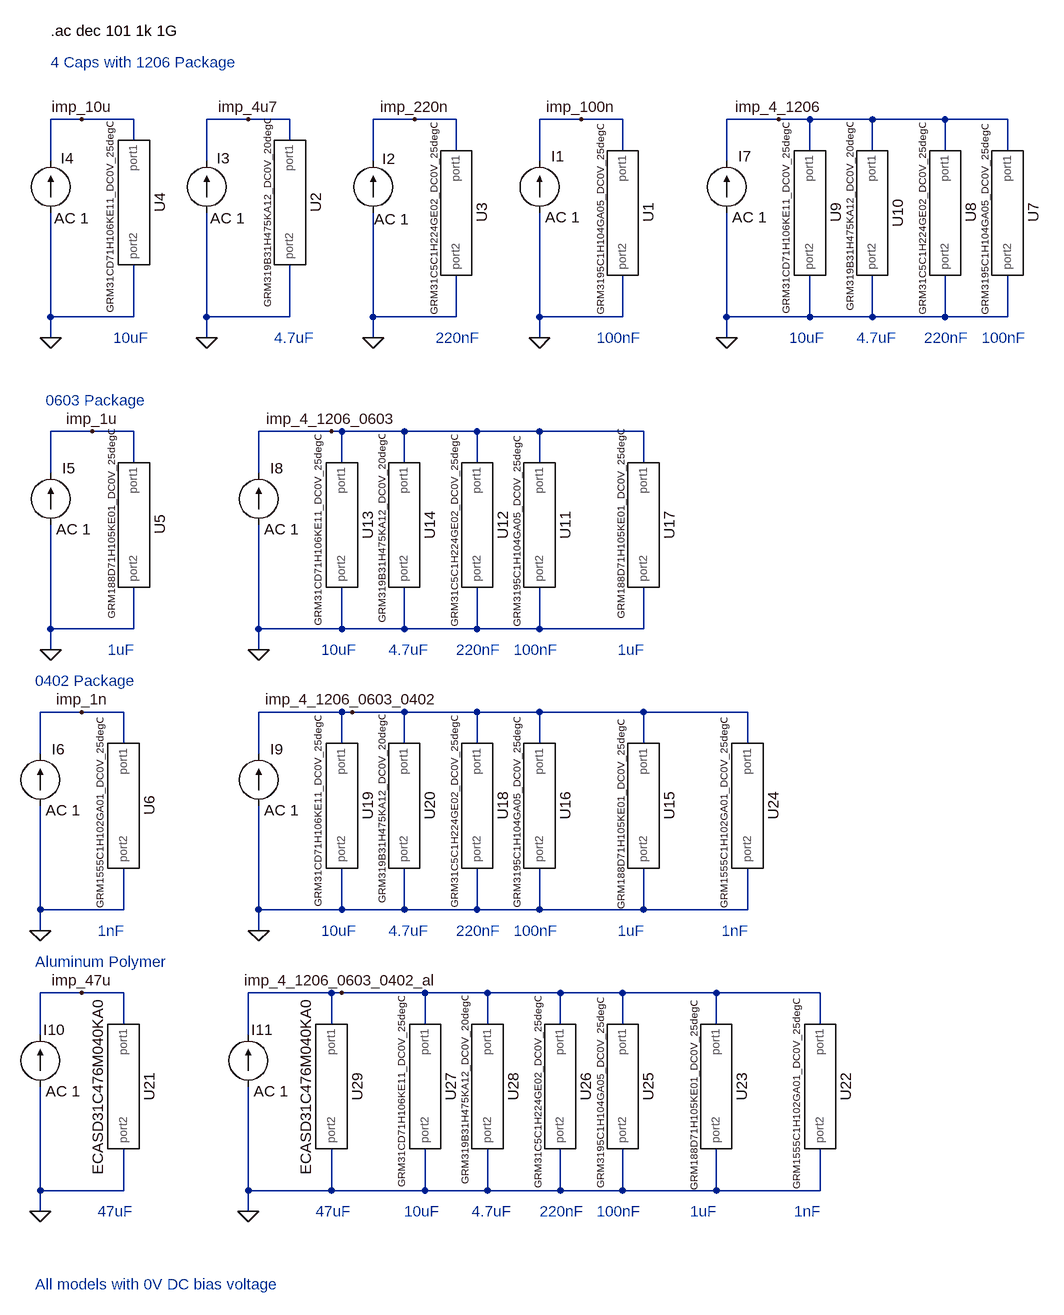
[diagram p0: schematic 02-4cap_same_size_murata.asc]
02-4cap_same_size_murata.asc, the LTspice schematic file:
Version 4
SHEET 1 2248 1864
WIRE 160 48 112 48
WIRE 240 48 160 48
WIRE 416 48 352 48
WIRE 480 48 416 48
WIRE 672 48 608 48
WIRE 736 48 672 48
WIRE 928 48 864 48
WIRE 992 48 928 48
WIRE 1232 48 1152 48
WIRE 1280 48 1232 48
WIRE 1376 48 1280 48
WIRE 1488 48 1376 48
WIRE 1584 48 1488 48
WIRE 240 80 240 48
WIRE 480 80 480 48
WIRE 736 96 736 48
WIRE 992 96 992 48
WIRE 1280 96 1280 48
WIRE 1376 96 1376 48
WIRE 1488 96 1488 48
WIRE 1584 96 1584 48
WIRE 112 112 112 48
WIRE 352 112 352 48
WIRE 608 112 608 48
WIRE 864 112 864 48
WIRE 1152 112 1152 48
WIRE 112 352 112 192
WIRE 240 352 240 272
WIRE 240 352 112 352
WIRE 352 352 352 192
WIRE 480 352 480 272
WIRE 480 352 352 352
WIRE 608 352 608 192
WIRE 736 352 736 288
WIRE 736 352 608 352
WIRE 864 352 864 192
WIRE 992 352 992 288
WIRE 992 352 864 352
WIRE 1152 352 1152 192
WIRE 1280 352 1280 288
WIRE 1280 352 1152 352
WIRE 1376 352 1376 288
WIRE 1376 352 1280 352
WIRE 1488 352 1488 288
WIRE 1488 352 1376 352
WIRE 1584 352 1584 288
WIRE 1584 352 1488 352
WIRE 112 384 112 352
WIRE 352 384 352 352
WIRE 608 384 608 352
WIRE 864 384 864 352
WIRE 1152 384 1152 352
WIRE 176 528 112 528
WIRE 240 528 176 528
WIRE 544 528 432 528
WIRE 560 528 544 528
WIRE 656 528 560 528
WIRE 768 528 656 528
WIRE 864 528 768 528
WIRE 1024 528 864 528
WIRE 240 576 240 528
WIRE 560 576 560 528
WIRE 656 576 656 528
WIRE 768 576 768 528
WIRE 864 576 864 528
WIRE 1024 576 1024 528
WIRE 112 592 112 528
WIRE 432 592 432 528
WIRE 112 832 112 672
WIRE 240 832 240 768
WIRE 240 832 112 832
WIRE 432 832 432 672
WIRE 560 832 560 768
WIRE 560 832 432 832
WIRE 656 832 656 768
WIRE 656 832 560 832
WIRE 768 832 768 768
WIRE 768 832 656 832
WIRE 864 832 864 768
WIRE 864 832 768 832
WIRE 1024 832 1024 768
WIRE 1024 832 864 832
WIRE 112 864 112 832
WIRE 432 864 432 832
WIRE 160 960 96 960
WIRE 224 960 160 960
WIRE 560 960 432 960
WIRE 576 960 560 960
WIRE 656 960 576 960
WIRE 768 960 656 960
WIRE 864 960 768 960
WIRE 1024 960 864 960
WIRE 1184 960 1024 960
WIRE 224 1008 224 960
WIRE 560 1008 560 960
WIRE 656 1008 656 960
WIRE 768 1008 768 960
WIRE 864 1008 864 960
WIRE 1024 1008 1024 960
WIRE 1184 1008 1184 960
WIRE 96 1024 96 960
WIRE 432 1024 432 960
WIRE 96 1264 96 1104
WIRE 224 1264 224 1200
WIRE 224 1264 96 1264
WIRE 432 1264 432 1104
WIRE 560 1264 560 1200
WIRE 560 1264 432 1264
WIRE 656 1264 656 1200
WIRE 656 1264 560 1264
WIRE 768 1264 768 1200
WIRE 768 1264 656 1264
WIRE 864 1264 864 1200
WIRE 864 1264 768 1264
WIRE 1024 1264 1024 1200
WIRE 1024 1264 864 1264
WIRE 1184 1264 1184 1200
WIRE 1184 1264 1024 1264
WIRE 96 1296 96 1264
WIRE 432 1296 432 1264
WIRE 160 1392 96 1392
WIRE 224 1392 160 1392
WIRE 544 1392 416 1392
WIRE 560 1392 544 1392
WIRE 688 1392 560 1392
WIRE 784 1392 688 1392
WIRE 896 1392 784 1392
WIRE 992 1392 896 1392
WIRE 1136 1392 992 1392
WIRE 1296 1392 1136 1392
WIRE 224 1440 224 1392
WIRE 544 1440 544 1392
WIRE 688 1440 688 1392
WIRE 784 1440 784 1392
WIRE 896 1440 896 1392
WIRE 992 1440 992 1392
WIRE 1136 1440 1136 1392
WIRE 1296 1440 1296 1392
WIRE 96 1456 96 1392
WIRE 416 1456 416 1392
WIRE 96 1696 96 1536
WIRE 224 1696 224 1632
WIRE 224 1696 96 1696
WIRE 416 1696 416 1536
WIRE 544 1696 544 1632
WIRE 544 1696 416 1696
WIRE 688 1696 688 1632
WIRE 688 1696 544 1696
WIRE 784 1696 784 1632
WIRE 784 1696 688 1696
WIRE 896 1696 896 1632
WIRE 896 1696 784 1696
WIRE 992 1696 992 1632
WIRE 992 1696 896 1696
WIRE 1136 1696 1136 1632
WIRE 1136 1696 992 1696
WIRE 1296 1696 1296 1632
WIRE 1296 1696 1136 1696
WIRE 96 1728 96 1696
WIRE 416 1728 416 1696
FLAG 864 384 0
FLAG 928 48 imp_100n
FLAG 608 384 0
FLAG 672 48 imp_220n
FLAG 352 384 0
FLAG 416 48 imp_4u7
FLAG 112 384 0
FLAG 160 48 imp_10u
FLAG 112 864 0
FLAG 176 528 imp_1u
FLAG 96 1296 0
FLAG 160 960 imp_1n
FLAG 1152 384 0
FLAG 1232 48 imp_4_1206
FLAG 432 864 0
FLAG 544 528 imp_4_1206_0603
FLAG 432 1296 0
FLAG 576 960 imp_4_1206_0603_0402
FLAG 96 1728 0
FLAG 160 1392 imp_47u
FLAG 416 1728 0
FLAG 560 1392 imp_4_1206_0603_0402_al
SYMBOL GRM3195C1H104GA05_DC0V_25degC 992 192 R90
WINDOW 3 12 24 Top 1
SYMATTR InstName U1
SYMBOL GRM31C5C1H224GE02_DC0V_25degC 736 192 R90
WINDOW 3 11 24 Top 1
SYMATTR InstName U3
SYMBOL GRM31CD71H106KE11_DC0V_25degC 240 176 R90
WINDOW 3 24 26 Top 1
SYMATTR InstName U4
SYMBOL current 864 192 R180
WINDOW 0 -38 87 Left 2
WINDOW 3 24 0 Left 2
WINDOW 123 -62 -7 Left 2
WINDOW 39 0 0 Left 0
SYMATTR InstName I1
SYMATTR Value ""
SYMATTR Value2 AC 1
SYMBOL GRM319B31H475KA12_DC0V_20degC 480 176 R90
WINDOW 3 18 24 Top 1
SYMATTR InstName U2
SYMBOL current 608 192 R180
WINDOW 0 -34 83 Left 2
WINDOW 3 24 0 Left 2
WINDOW 123 -55 -10 Left 2
WINDOW 39 0 0 Left 0
SYMATTR InstName I2
SYMATTR Value ""
SYMATTR Value2 AC 1
SYMBOL current 352 192 R180
WINDOW 0 -36 84 Left 2
WINDOW 3 24 0 Left 2
WINDOW 123 -59 -8 Left 2
WINDOW 39 0 0 Left 0
SYMATTR InstName I3
SYMATTR Value ""
SYMATTR Value2 AC 1
SYMBOL current 112 192 R180
WINDOW 0 -36 84 Left 2
WINDOW 3 24 0 Left 2
WINDOW 123 -59 -8 Left 2
WINDOW 39 0 0 Left 0
SYMATTR InstName I4
SYMATTR Value ""
SYMATTR Value2 AC 1
SYMBOL GRM188D71H105KE01_DC0V_25degC 240 672 R90
WINDOW 3 0 24 Top 1
SYMATTR InstName U5
SYMBOL current 112 672 R180
WINDOW 0 -38 87 Left 2
WINDOW 3 24 0 Left 2
WINDOW 123 -62 -7 Left 2
WINDOW 39 0 0 Left 0
SYMATTR InstName I5
SYMATTR Value ""
SYMATTR Value2 AC 1
SYMBOL GRM1555C1H102GA01_DC0V_25degC 224 1104 R90
WINDOW 3 13 26 Top 1
SYMATTR InstName U6
SYMBOL current 96 1104 R180
WINDOW 0 -38 87 Left 2
WINDOW 3 24 0 Left 2
WINDOW 123 -62 -7 Left 2
WINDOW 39 0 0 Left 0
SYMATTR InstName I6
SYMATTR Value ""
SYMATTR Value2 AC 1
SYMBOL GRM3195C1H104GA05_DC0V_25degC 1584 192 R90
WINDOW 3 12 24 Top 1
SYMATTR InstName U7
SYMBOL GRM31C5C1H224GE02_DC0V_25degC 1488 192 R90
WINDOW 3 11 24 Top 1
SYMATTR InstName U8
SYMBOL GRM31CD71H106KE11_DC0V_25degC 1280 192 R90
WINDOW 3 10 26 Top 1
SYMATTR InstName U9
SYMBOL current 1152 192 R180
WINDOW 0 -38 87 Left 2
WINDOW 3 24 0 Left 2
WINDOW 123 -62 -7 Left 2
WINDOW 39 0 0 Left 0
SYMATTR InstName I7
SYMATTR Value ""
SYMATTR Value2 AC 1
SYMBOL GRM319B31H475KA12_DC0V_20degC 1376 192 R90
WINDOW 3 7 24 Top 1
SYMATTR InstName U10
SYMBOL current 432 672 R180
WINDOW 0 -38 87 Left 2
WINDOW 3 24 0 Left 2
WINDOW 123 -62 -7 Left 2
WINDOW 39 0 0 Left 0
SYMATTR InstName I8
SYMATTR Value ""
SYMATTR Value2 AC 1
SYMBOL GRM188D71H105KE01_DC0V_25degC 1024 672 R90
WINDOW 3 0 24 Top 1
SYMATTR InstName U17
SYMBOL current 432 1104 R180
WINDOW 0 -38 87 Left 2
WINDOW 3 24 0 Left 2
WINDOW 123 -62 -7 Left 2
WINDOW 39 0 0 Left 0
SYMATTR InstName I9
SYMATTR Value ""
SYMATTR Value2 AC 1
SYMBOL GRM1555C1H102GA01_DC0V_25degC 1184 1104 R90
WINDOW 3 13 26 Top 1
SYMATTR InstName U24
SYMBOL GRM3195C1H104GA05_DC0V_25degC 864 672 R90
WINDOW 3 12 24 Top 1
SYMATTR InstName U11
SYMBOL GRM31C5C1H224GE02_DC0V_25degC 768 672 R90
WINDOW 3 11 24 Top 1
SYMATTR InstName U12
SYMBOL GRM31CD71H106KE11_DC0V_25degC 560 672 R90
WINDOW 3 10 26 Top 1
SYMATTR InstName U13
SYMBOL GRM319B31H475KA12_DC0V_20degC 656 672 R90
WINDOW 3 7 24 Top 1
SYMATTR InstName U14
SYMBOL GRM188D71H105KE01_DC0V_25degC 1024 1104 R90
WINDOW 3 15 24 Top 1
SYMATTR InstName U15
SYMBOL GRM3195C1H104GA05_DC0V_25degC 864 1104 R90
WINDOW 3 12 24 Top 1
SYMATTR InstName U16
SYMBOL GRM31C5C1H224GE02_DC0V_25degC 768 1104 R90
WINDOW 3 11 24 Top 1
SYMATTR InstName U18
SYMBOL GRM31CD71H106KE11_DC0V_25degC 560 1104 R90
WINDOW 3 10 26 Top 1
SYMATTR InstName U19
SYMBOL GRM319B31H475KA12_DC0V_20degC 656 1104 R90
WINDOW 3 7 24 Top 1
SYMATTR InstName U20
SYMBOL ECASD31C476M040KA0 224 1536 R90
SYMATTR InstName U21
SYMBOL current 96 1536 R180
WINDOW 0 -38 87 Left 2
WINDOW 3 24 0 Left 2
WINDOW 123 -62 -7 Left 2
WINDOW 39 0 0 Left 0
SYMATTR InstName I10
SYMATTR Value ""
SYMATTR Value2 AC 1
SYMBOL current 416 1536 R180
WINDOW 0 -38 87 Left 2
WINDOW 3 24 0 Left 2
WINDOW 123 -62 -7 Left 2
WINDOW 39 0 0 Left 0
SYMATTR InstName I11
SYMATTR Value ""
SYMATTR Value2 AC 1
SYMBOL GRM1555C1H102GA01_DC0V_25degC 1296 1536 R90
WINDOW 3 13 26 Top 1
SYMATTR InstName U22
SYMBOL GRM188D71H105KE01_DC0V_25degC 1136 1536 R90
WINDOW 3 15 24 Top 1
SYMATTR InstName U23
SYMBOL GRM3195C1H104GA05_DC0V_25degC 992 1536 R90
WINDOW 3 12 24 Top 1
SYMATTR InstName U25
SYMBOL GRM31C5C1H224GE02_DC0V_25degC 896 1536 R90
WINDOW 3 11 24 Top 1
SYMATTR InstName U26
SYMBOL GRM31CD71H106KE11_DC0V_25degC 688 1536 R90
WINDOW 3 10 26 Top 1
SYMATTR InstName U27
SYMBOL GRM319B31H475KA12_DC0V_20degC 784 1536 R90
WINDOW 3 7 24 Top 1
SYMATTR InstName U28
SYMBOL ECASD31C476M040KA0 544 1536 R90
SYMATTR InstName U29
TEXT 952 384 Left 2 ;100nF
TEXT 704 384 Left 2 ;220nF
TEXT 456 384 Left 2 ;4.7uF
TEXT 208 384 Left 2 ;10uF
TEXT 112 -88 Left 2 !.ac dec 101 1k 1G
TEXT 112 -40 Left 2 ;4 Caps with 1206 Package
TEXT 200 864 Left 2 ;1uF
TEXT 104 480 Left 2 ;0603 Package
TEXT 184 1296 Left 2 ;1nF
TEXT 88 912 Left 2 ;0402 Package
TEXT 1544 384 Left 2 ;100nF
TEXT 1456 384 Left 2 ;220nF
TEXT 1352 384 Left 2 ;4.7uF
TEXT 1248 384 Left 2 ;10uF
TEXT 984 864 Left 2 ;1uF
TEXT 1144 1296 Left 2 ;1nF
TEXT 824 864 Left 2 ;100nF
TEXT 736 864 Left 2 ;220nF
TEXT 632 864 Left 2 ;4.7uF
TEXT 528 864 Left 2 ;10uF
TEXT 984 1296 Left 2 ;1uF
TEXT 824 1296 Left 2 ;100nF
TEXT 736 1296 Left 2 ;220nF
TEXT 632 1296 Left 2 ;4.7uF
TEXT 528 1296 Left 2 ;10uF
TEXT 184 1728 Left 2 ;47uF
TEXT 88 1344 Left 2 ;Aluminum Polymer
TEXT 1256 1728 Left 2 ;1nF
TEXT 1096 1728 Left 2 ;1uF
TEXT 952 1728 Left 2 ;100nF
TEXT 864 1728 Left 2 ;220nF
TEXT 760 1728 Left 2 ;4.7uF
TEXT 656 1728 Left 2 ;10uF
TEXT 520 1728 Left 2 ;47uF
TEXT 88 1840 Left 2 ;All models with 0V DC bias voltage

The netlist it stands for:
* 02-4cap_same_size_murata.asc
XU1 imp_100n 0 GRM3195C1H104GA05_DC0V_25degC  ; pins port1 port2
XU3 imp_220n 0 GRM31C5C1H224GE02_DC0V_25degC  ; pins port1 port2
XU4 imp_10u 0 GRM31CD71H106KE11_DC0V_25degC  ; pins port1 port2
I1 0 imp_100n AC 1
XU2 imp_4u7 0 GRM319B31H475KA12_DC0V_20degC  ; pins port1 port2
I2 0 imp_220n AC 1
I3 0 imp_4u7 AC 1
I4 0 imp_10u AC 1
XU5 imp_1u 0 GRM188D71H105KE01_DC0V_25degC  ; pins port1 port2
I5 0 imp_1u AC 1
XU6 imp_1n 0 GRM1555C1H102GA01_DC0V_25degC  ; pins port1 port2
I6 0 imp_1n AC 1
XU7 imp_4_1206 0 GRM3195C1H104GA05_DC0V_25degC  ; pins port1 port2
XU8 imp_4_1206 0 GRM31C5C1H224GE02_DC0V_25degC  ; pins port1 port2
XU9 imp_4_1206 0 GRM31CD71H106KE11_DC0V_25degC  ; pins port1 port2
I7 0 imp_4_1206 AC 1
XU10 imp_4_1206 0 GRM319B31H475KA12_DC0V_20degC  ; pins port1 port2
I8 0 imp_4_1206_0603 AC 1
XU17 imp_4_1206_0603 0 GRM188D71H105KE01_DC0V_25degC  ; pins port1 port2
I9 0 imp_4_1206_0603_0402 AC 1
XU24 imp_4_1206_0603_0402 0 GRM1555C1H102GA01_DC0V_25degC  ; pins port1 port2
XU11 imp_4_1206_0603 0 GRM3195C1H104GA05_DC0V_25degC  ; pins port1 port2
XU12 imp_4_1206_0603 0 GRM31C5C1H224GE02_DC0V_25degC  ; pins port1 port2
XU13 imp_4_1206_0603 0 GRM31CD71H106KE11_DC0V_25degC  ; pins port1 port2
XU14 imp_4_1206_0603 0 GRM319B31H475KA12_DC0V_20degC  ; pins port1 port2
XU15 imp_4_1206_0603_0402 0 GRM188D71H105KE01_DC0V_25degC  ; pins port1 port2
XU16 imp_4_1206_0603_0402 0 GRM3195C1H104GA05_DC0V_25degC  ; pins port1 port2
XU18 imp_4_1206_0603_0402 0 GRM31C5C1H224GE02_DC0V_25degC  ; pins port1 port2
XU19 imp_4_1206_0603_0402 0 GRM31CD71H106KE11_DC0V_25degC  ; pins port1 port2
XU20 imp_4_1206_0603_0402 0 GRM319B31H475KA12_DC0V_20degC  ; pins port1 port2
XU21 imp_47u 0 ECASD31C476M040KA0  ; pins port1 port2
I10 0 imp_47u AC 1
I11 0 imp_4_1206_0603_0402_al AC 1
XU22 imp_4_1206_0603_0402_al 0 GRM1555C1H102GA01_DC0V_25degC  ; pins port1 port2
XU23 imp_4_1206_0603_0402_al 0 GRM188D71H105KE01_DC0V_25degC  ; pins port1 port2
XU25 imp_4_1206_0603_0402_al 0 GRM3195C1H104GA05_DC0V_25degC  ; pins port1 port2
XU26 imp_4_1206_0603_0402_al 0 GRM31C5C1H224GE02_DC0V_25degC  ; pins port1 port2
XU27 imp_4_1206_0603_0402_al 0 GRM31CD71H106KE11_DC0V_25degC  ; pins port1 port2
XU28 imp_4_1206_0603_0402_al 0 GRM319B31H475KA12_DC0V_20degC  ; pins port1 port2
XU29 imp_4_1206_0603_0402_al 0 ECASD31C476M040KA0  ; pins port1 port2
* 100nF
* 220nF
* 4.7uF
* 10uF
.ac dec 101 1k 1G
* 4 Caps with 1206 Package
* 1uF
* 0603 Package
* 1nF
* 0402 Package
* 100nF
* 220nF
* 4.7uF
* 10uF
* 1uF
* 1nF
* 100nF
* 220nF
* 4.7uF
* 10uF
* 1uF
* 100nF
* 220nF
* 4.7uF
* 10uF
* 47uF
* Aluminum Polymer
* 1nF
* 1uF
* 100nF
* 220nF
* 4.7uF
* 10uF
* 47uF
* All models with 0V DC bias voltage
.lib GRM3195C1H104GA05_DC0V_25degC.mod
.lib GRM31C5C1H224GE02_DC0V_25degC.mod
.lib GRM31CD71H106KE11_DC0V_25degC.mod
.lib GRM319B31H475KA12_DC0V_20degC.mod
.lib GRM188D71H105KE01_DC0V_25degC.mod
.lib GRM1555C1H102GA01_DC0V_25degC.mod
.lib ECASD31C476M040KA0.mod
.backanno
.end

* Results of the author's LTspice run, read from the files saved beside the schematic
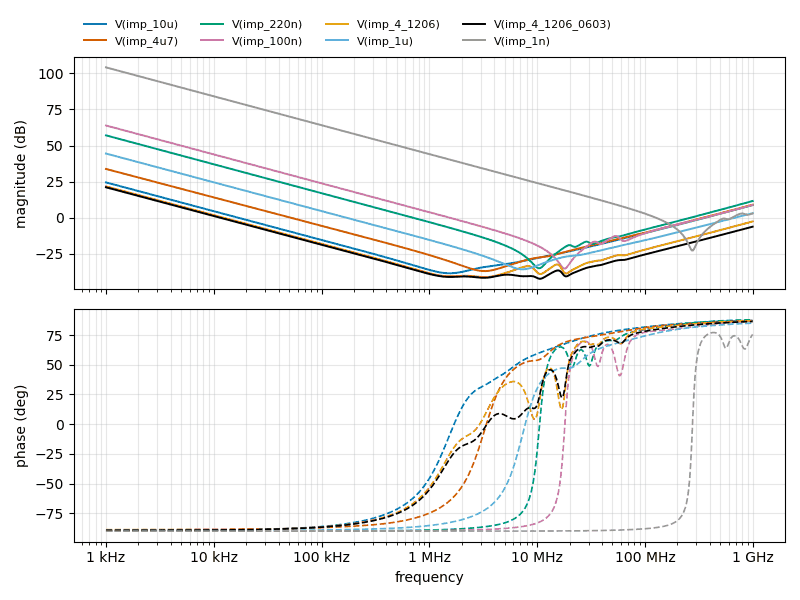
[diagram p1: AC Analysis of 02-4cap_same_size_murata.asc, plotted from the saved traces]
* AC Analysis, 1 run:
*   V(imp_10u): 24.46 dB at 1 kHz, 8.76 dB at 1 GHz, peak 24.46 dB at 1 kHz, 3 dB below the peak at 1.417 kHz
*   V(imp_4u7): 33.77 dB at 1 kHz, 9.01 dB at 1 GHz, peak 33.77 dB at 1 kHz, 3 dB below the peak at 1.421 kHz
*   V(imp_220n): 57.03 dB at 1 kHz, 11.57 dB at 1 GHz, peak 57.03 dB at 1 kHz, 3 dB below the peak at 1.414 kHz
*   V(imp_100n): 63.86 dB at 1 kHz, 8.81 dB at 1 GHz, peak 63.86 dB at 1 kHz, 3 dB below the peak at 1.414 kHz
*   V(imp_4_1206): 21.68 dB at 1 kHz, -2.58 dB at 1 GHz, peak 21.68 dB at 1 kHz, 3 dB below the peak at 1.418 kHz
*   V(imp_1u): 44.44 dB at 1 kHz, 3.15 dB at 1 GHz, peak 44.44 dB at 1 kHz, 3 dB below the peak at 1.417 kHz
*   V(imp_4_1206_0603): 21.07 dB at 1 kHz, -6.20 dB at 1 GHz, peak 21.07 dB at 1 kHz, 3 dB below the peak at 1.418 kHz
*   V(imp_1n): 104.10 dB at 1 kHz, 2.98 dB at 1 GHz, peak 104.10 dB at 1 kHz, 3 dB below the peak at 1.414 kHz